# Altium schematic sheet GDE_Driver.SchDoc
size A4
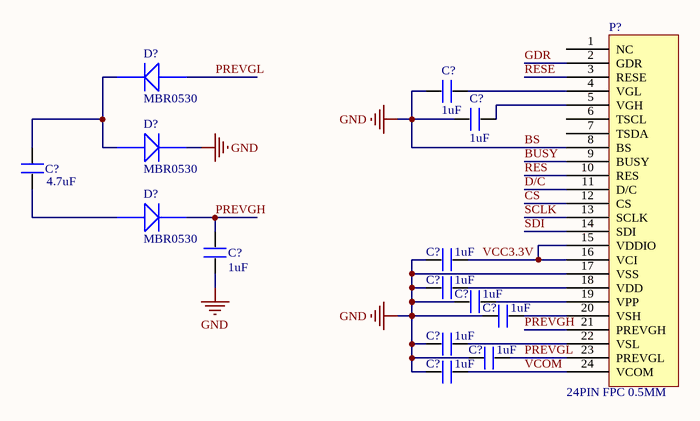
[diagram p0: GDE_Driver.SchDoc]

## Parts
(Parts that share a designator on the sheet are numbered #1, #2 ... from top to bottom, then left to right.)
C?#1  1uF  [0603P]
C?#2  1uF  [0603P]
C?#3  1uF  [0603P]
C?#4  4.7uF  [0603P]
C?#5  1uF  [0603P]
C?#6  1uF  [0603P]
C?#7  1uF  [0603P]
C?#8  1uF  [0603P]
C?#9  1uF  [0603P]
C?#10  1uF  [0603P]
C?#11  1uF  [0603P]
D?#1  MBR0530
D?#2  MBR0530
D?#3  MBR0530
P?  24PIN FPC 0.5MM

## Nets
BS: C?#1.1 C?#2.1 C?#3.1 C?#5.1 C?#6.1 C?#7.1 C?#8.1 C?#9.1 C?#10.1 C?#11.1 D?#2.2 P?.8(BS) P?.17(VSS)  [also labelled GND]
BUSY: P?.9(BUSY)
CS: P?.12(CS)
D/C: P?.11(D/C)
GDR: P?.2(GDR)
PREVGH: C?#10.2 D?#3.2 P?.21(PREVGH)
PREVGL: C?#9.2 D?#1.1 P?.23(PREVGL)
RES: P?.10(RES)
RESE: P?.3(RESE)
SCLK: P?.13(SCLK)
SDI: P?.14(SDI)
VCC3.3V: C?#3.2 P?.15(VDDIO) P?.16(VCI)
VCOM: C?#11.2 P?.24(VCOM)
NetC?#1_2: C?#1.2 P?.4(VGL)
NetC?#2_2: C?#2.2 P?.5(VGH)
NetC?#4_1: C?#4.1 D?#3.1
NetC?#4_2: C?#4.2 D?#1.2 D?#2.1
NetC?#5_2: C?#5.2 P?.18(VDD)
NetC?#6_2: C?#6.2 P?.19(VPP)
NetC?#7_2: C?#7.2 P?.20(VSH)
NetC?#8_2: C?#8.2 P?.22(VSL)

Not connected (* = marked no-connect by the designer): P? 1(NC) 6(TSCL) 7(TSDA)

## Library data of the parts
C?#1-C?#3 C?#5-C?#11 = C_2: 1uF/50V
C?#4 = C_2: 4.7uF/50V
P? = FPC-24P